# Altium schematic sheet sdcard_emmc.SchDoc
size A4
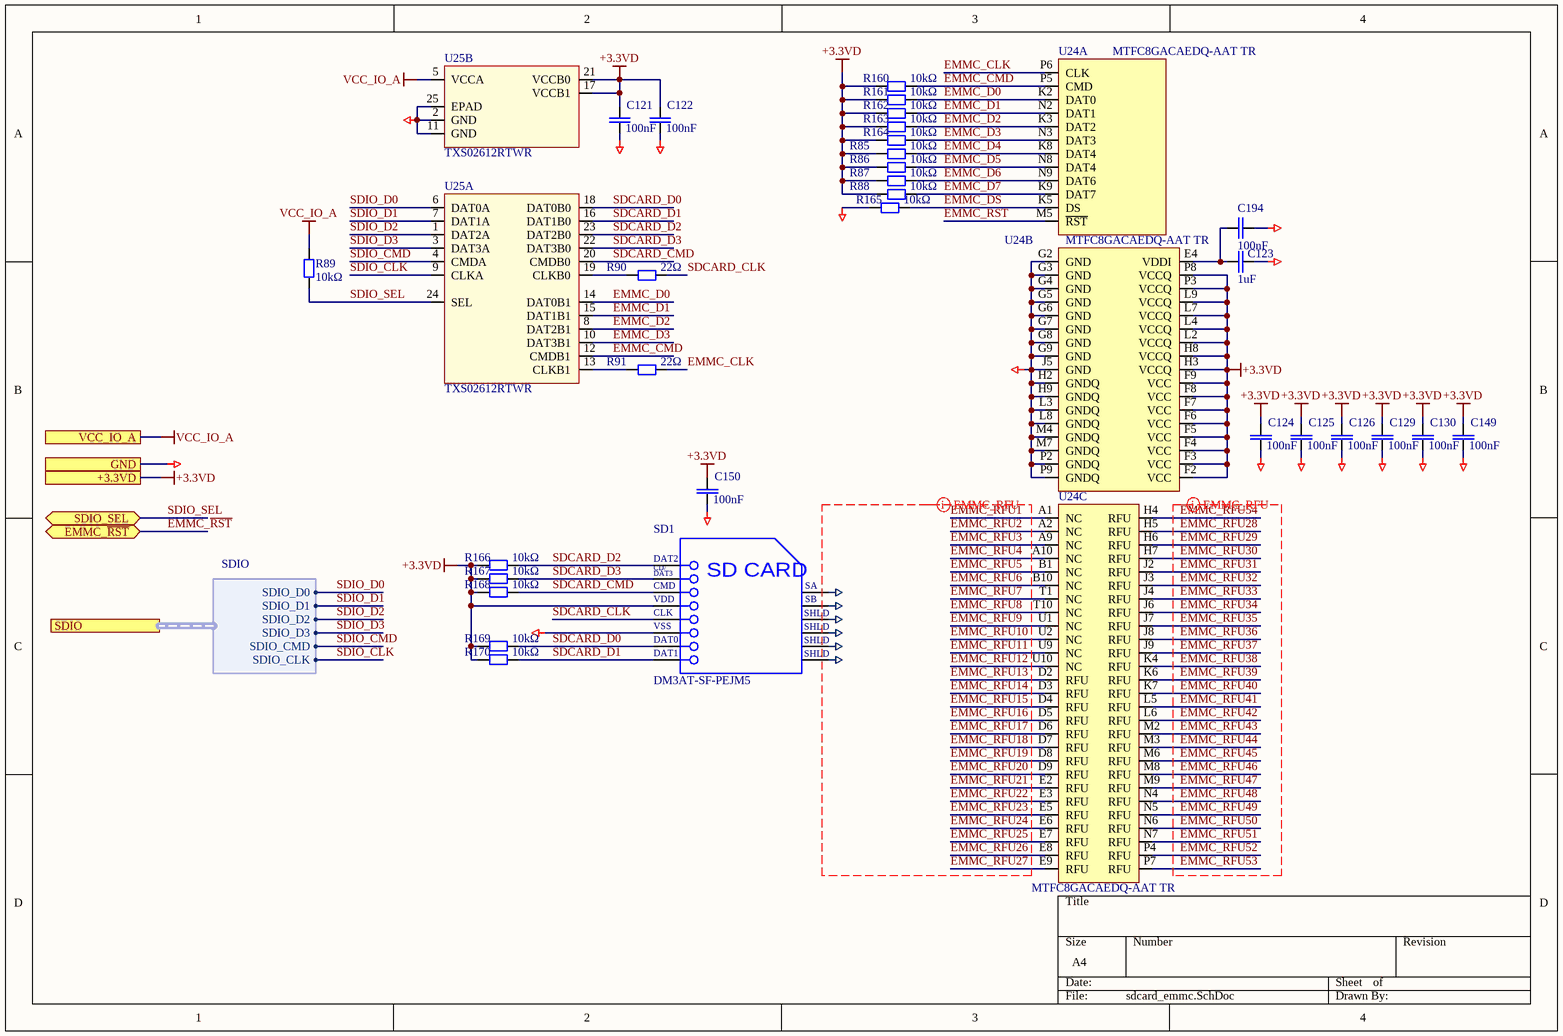
[diagram p0: sdcard_emmc.SchDoc]

## Parts
C121  100nF  [CAPC1608N]
C122  100nF  [CAPC1608N]
C123  1uF  [CAPC2012N]
C124  100nF  [CAPC1608N]
C125  100nF  [CAPC1608N]
C126  100nF  [CAPC1608N]
C129  100nF  [CAPC1608N]
C130  100nF  [CAPC1608N]
C149  100nF  [CAPC1608N]
C150  100nF  [CAPC1608N]
C194  100nF  [CAPC1608N]
R85  10kΩ  [RESC2012N]
R86  10kΩ  [RESC2012N]
R87  10kΩ  [RESC2012N]
R88  10kΩ  [RESC2012N]
R89  10kΩ  [RESC2012N]
R90  22Ω  [RESC1608N]
R91  22Ω  [RESC1608N]
R160  10kΩ  [RESC2012N]
R161  10kΩ  [RESC2012N]
R162  10kΩ  [RESC2012N]
R163  10kΩ  [RESC2012N]
R164  10kΩ  [RESC2012N]
R165  10kΩ  [RESC2012N]
R166  10kΩ  [RESC2012N]
R167  10kΩ  [RESC2012N]
R168  10kΩ  [RESC2012N]
R169  10kΩ  [RESC2012N]
R170  10kΩ  [RESC2012N]
SD1  DM3AT-SF-PEJM5  [SD_HRS-DM3AT-8_V]
U24  MTFC8GACAEDQ-AAT TR  [BGA100C100P10X17_1400X1800X120]  (parts A,B,C of 3)
U25  TXS02612RTWR  [QFN50P400X400X80-25N-S245]  (parts A,B of 2)

## Ports
+3.3VD, EMMC_~{RST} (bidir), GND, SDIO (harness SDIO), SDIO_SEL (bidir), VCC_IO_A

## Harnesses
SDIO: SDIO_D0, SDIO_D1, SDIO_D2, SDIO_D3, SDIO_CMD, SDIO_CLK

## Nets
+3.3VD: C121.1 C122.1 C124.1 C125.1 C126.1 C129.1 C130.1 C149.1 C150.1 R85.1 R86.1 R87.1 R88.1 R160.1 R161.1 R162.1 R163.1 R164.1 R166.1 R167.1 R168.1 R169.1 R170.1 SD1.4(VDD) U24.F2(VCC) U24.F3(VCC) U24.F4(VCC) U24.F5(VCC) U24.F6(VCC) U24.F7(VCC) U24.F8(VCC) U24.F9(VCC) U24.H3(VCCQ) U24.H8(VCCQ) U24.L2(VCCQ) U24.L4(VCCQ) U24.L7(VCCQ) U24.L9(VCCQ) U24.P3(VCCQ) U24.P8(VCCQ) U25.17(VCCB1) U25.21(VCCB0) ; port +3.3VD
GND: C121.2 C122.2 C123.1 C124.2 C125.2 C126.2 C129.2 C130.2 C149.2 C150.2 C194.2 R165.1 SD1.6(VSS) U24.G2(GND) U24.G3(GND) U24.G4(GND) U24.G5(GND) U24.G6(GND) U24.G7(GND) U24.G8(GND) U24.G9(GND) U24.H2(GNDQ) U24.H9(GNDQ) U24.J5(GND) U24.L3(GNDQ) U24.L8(GNDQ) U24.M4(GNDQ) U24.M7(GNDQ) U24.P2(GNDQ) U24.P9(GNDQ) U25.2(GND) U25.11(GND) U25.25(EPAD) ; port GND
SDEPAD1: SD1.9(SA)
SDEPAD2: SD1.10(SB)
SDEPAD3: SD1.11(SHLD)
SDEPAD4: SD1.13(SHLD)
SDEPAD5: SD1.12(SHLD)
SDEPAD6: SD1.14(SHLD)
VCC_IO_A: R89.2 U25.5(VCCA) ; port VCC_IO_A
EMMC_CLK: R91.2 U24.P6(CLK)
EMMC_CMD: R160.2 U24.P5(CMD) U25.12(CMDB1)
EMMC_D0: R161.2 U24.K2(DAT0) U25.14(DAT0B1)
EMMC_D1: R162.2 U24.N2(DAT1) U25.15(DAT1B1)
EMMC_D2: R163.2 U24.K3(DAT2) U25.8(DAT2B1)
EMMC_D3: R164.2 U24.N3(DAT3) U25.10(DAT3B1)
EMMC_D4: R85.2 U24.K8(DAT4)
EMMC_D5: R86.2 U24.N8(DAT4)
EMMC_D6: R87.2 U24.N9(DAT6)
EMMC_D7: R88.2 U24.K9(DAT7)
EMMC_DS: R165.2 U24.K5(DS)
EMMC_~{RST}: U24.M5(~{RST}) ; port EMMC_~{RST}
EMMC_RFU1: U24.A1(NC)
EMMC_RFU2: U24.A2(NC)
EMMC_RFU3: U24.A9(NC)
EMMC_RFU4: U24.A10(NC)
EMMC_RFU5: U24.B1(NC)
EMMC_RFU6: U24.B10(NC)
EMMC_RFU7: U24.T1(NC)
EMMC_RFU8: U24.T10(NC)
EMMC_RFU9: U24.U1(NC)
EMMC_RFU10: U24.U2(NC)
EMMC_RFU11: U24.U9(NC)
EMMC_RFU12: U24.U10(NC)
EMMC_RFU13: U24.D2(RFU)
EMMC_RFU14: U24.D3(RFU)
EMMC_RFU15: U24.D4(RFU)
EMMC_RFU16: U24.D5(RFU)
EMMC_RFU17: U24.D6(RFU)
EMMC_RFU18: U24.D7(RFU)
EMMC_RFU19: U24.D8(RFU)
EMMC_RFU20: U24.D9(RFU)
EMMC_RFU21: U24.E2(RFU)
EMMC_RFU22: U24.E3(RFU)
EMMC_RFU23: U24.E5(RFU)
EMMC_RFU24: U24.E6(RFU)
EMMC_RFU25: U24.E7(RFU)
EMMC_RFU26: U24.E8(RFU)
EMMC_RFU27: U24.E9(RFU)
EMMC_RFU28: U24.H5(RFU)
EMMC_RFU29: U24.H6(RFU)
EMMC_RFU30: U24.H7(RFU)
EMMC_RFU31: U24.J2(RFU)
EMMC_RFU32: U24.J3(RFU)
EMMC_RFU33: U24.J4(RFU)
EMMC_RFU34: U24.J6(RFU)
EMMC_RFU35: U24.J7(RFU)
EMMC_RFU36: U24.J8(RFU)
EMMC_RFU37: U24.J9(RFU)
EMMC_RFU38: U24.K4(RFU)
EMMC_RFU39: U24.K6(RFU)
EMMC_RFU40: U24.K7(RFU)
EMMC_RFU41: U24.L5(RFU)
EMMC_RFU42: U24.L6(RFU)
EMMC_RFU43: U24.M2(RFU)
EMMC_RFU44: U24.M3(RFU)
EMMC_RFU45: U24.M6(RFU)
EMMC_RFU46: U24.M8(RFU)
EMMC_RFU47: U24.M9(RFU)
EMMC_RFU48: U24.N4(RFU)
EMMC_RFU49: U24.N5(RFU)
EMMC_RFU50: U24.N6(RFU)
EMMC_RFU51: U24.N7(RFU)
EMMC_RFU52: U24.P4(RFU)
EMMC_RFU53: U24.P7(RFU)
EMMC_RFU54: U24.H4(RFU)
SDCARD_CLK: R90.2 SD1.5(CLK)
SDCARD_CMD: R168.2 SD1.3(CMD) U25.20(CMDB0)
SDCARD_D0: R169.2 SD1.7(DAT0) U25.18(DAT0B0)
SDCARD_D1: R170.2 SD1.8(DAT1) U25.16(DAT1B0)
SDCARD_D2: R166.2 SD1.1(DAT2) U25.23(DAT2B0)
SDCARD_D3: R167.2 SD1.2(CD/DAT3) U25.22(DAT3B0)
SDIO_CLK: U25.9(CLKA) ; port SDIO.SDIO_CLK
SDIO_CMD: U25.4(CMDA) ; port SDIO.SDIO_CMD
SDIO_D0: U25.6(DAT0A) ; port SDIO.SDIO_D0
SDIO_D1: U25.7(DAT1A) ; port SDIO.SDIO_D1
SDIO_D2: U25.1(DAT2A) ; port SDIO.SDIO_D2
SDIO_D3: U25.3(DAT3A) ; port SDIO.SDIO_D3
SDIO_SEL: R89.1 U25.24(SEL) ; port SDIO_SEL
NetC123_2: C123.2 C194.1 U24.E4(VDDI)
NetR90_1: R90.1 U25.19(CLKB0)
NetR91_1: R91.1 U25.13(CLKB1)

## Layout directives
differential pair; net class EMMC_RFU: EMMC_RFU1, EMMC_RFU2, EMMC_RFU3, EMMC_RFU4, EMMC_RFU5, EMMC_RFU6, EMMC_RFU7, EMMC_RFU8, EMMC_RFU9, EMMC_RFU10, EMMC_RFU11, EMMC_RFU12, EMMC_RFU13, EMMC_RFU14, EMMC_RFU15, EMMC_RFU16, EMMC_RFU17, EMMC_RFU18, EMMC_RFU19, EMMC_RFU20, EMMC_RFU21, EMMC_RFU22, EMMC_RFU23, EMMC_RFU24, EMMC_RFU25, EMMC_RFU26, EMMC_RFU27, EMMC_RFU28, EMMC_RFU29, EMMC_RFU30, EMMC_RFU31, EMMC_RFU32, EMMC_RFU33, EMMC_RFU34, EMMC_RFU35, EMMC_RFU36, EMMC_RFU37, EMMC_RFU38, EMMC_RFU39, EMMC_RFU40, EMMC_RFU41, EMMC_RFU42, EMMC_RFU43, EMMC_RFU44, EMMC_RFU45, EMMC_RFU46, EMMC_RFU47, EMMC_RFU48, EMMC_RFU49, EMMC_RFU50, EMMC_RFU51, EMMC_RFU52, EMMC_RFU53, EMMC_RFU54, SDEPAD1, SDEPAD2, SDEPAD3, SDEPAD4, SDEPAD5, SDEPAD6

## Notes on the sheet
- (in symbol DM3AT-SF-PEJM5) CD/; DAT3; SD CARD

## Library data of the parts
C121 C122 C124-C126 C129 C130 C149 C150 C194 = CAPC: Generic ceramic SMD capacitor; Pkg: 0603; Maintainer: Evgeniy Kotov; SMD Solders: 2; THD Solders: 0; PartField: 100nF; Last Change Data: 06.03.2017; Release Date: 06.03.2017; Value: 100nF
C123 = CAPC: Generic ceramic SMD capacitor; Pkg: 0805; Maintainer: Evgeniy Kotov; SMD Solders: 2; THD Solders: 0; Voltage Rating: 10V; PartField: 1uF; Last Change Data: 06.03.2017; Release Date: 06.03.2017; Value: 1uF
R85-R89 R160-R170 = RESC: Resistor, Generic, SMD; Pkg: 0805; Maintainer: Evgeniy Kotov; SMD Solders: 2; THD Solders: 0; PartField: 10kΩ; Release Date: 06.03.2017; Last Change Data: 09.03.2017; Value: 10kΩ
R90 R91 = RESC: Resistor, Generic, SMD; Pkg: 0603; Maintainer: Evgeniy Kotov; SMD Solders: 2; THD Solders: 0; PartField: 22Ω; Release Date: 06.03.2017; Last Change Data: 09.03.2017; Value: 22Ω
SD1 = DM3AT-SF-PEJM5: Micro SD Card Connector, 0.5 A, 125 V, -25 to 85 degC, 8-Pin SMD, RoHS, Tape and Reel; Manufacturer: Hirose Electric; Featured Product: DM3ATSeries; HTML Datasheet: DM3SeriesmicroSD.html; Other Names: HR1964DKR; Connector Type: ConnectorandEjector; Insertion, Removal Method: PushIn,PushOut; Card Type: SecureDigital-microSD™; Online Catalog: DM3Series; Number of Positions: 10(8+2); Product Training Modules: DM3SeriesmicroSDCardSockets; Pkg: SD card hlder; SMD Solders: 14; THD Solders: 0; Manufacturer URL: https://www.hirose.com; Contact Finish: Gold; Family: MemoryConnectors-PCCardSockets; Package Reference: DM3AT-8; Category: Connectors,Interconnects; Features: Switch; Mounting Type: SurfaceMount,RightAngle; Datasheet Version: Jun-10; Package Description: 8-Pin Surface Mount Device, Body 16.15 x 13.85 mm, Pitch 1.1 mm; Standard Package: 1; Contact Finish Thickness: -; Datasheet URL: https://ciiva.com/datasheet-click-46418261?src=ciiva&sig=4019062a; Mounting Feature: Normal,Standard-Top; Series: DM3; Packaging: Digi-Reel; Package URL: https://www.hirose.com/product/en/download_file/key_name/DM3/category/Catalog/doc_file_id/49662/?file_category_id=4&item_id=195&is_series=1; Ejector Side: -; Value: DM3AT-SF-PEJM5; Vendor: Hirose Electric; PartField: DM3AT-SF-PEJM5
U24 = MTFC32GAKAENA: Pkg: LBGA-100; SMD Solders: 100; THD Solders: 0; Value: MTFC8GACAEDQ-AAT TR; PartField: MTFC8GACAEDQ-AAT TR
U25 = TXS02612_RTW_24: IC SDIO PORT EXPANDER AND LEVEL SHIFTER; Vendor: Texas Instruments; PACKAGE_DESIGNATOR: RTW; PIN_COUNT: 24; FAMILY_NAME: APPLICATION SPECIFIC (COMPACT FLASH, SD, MMC, I2C); INDUSTRY_STD_PKG_TYPE: QFN; Pkg: QFN-24EP; SMD Solders: 25; THD Solders: 0; Manufacturer_Part_Number: txs02612_rtw_24; GENERIC_PART_NUMBER: TXS02612RTWR; Datasheet URL: http://www.ti.com/lit/gpn/TXS02612; Manufacturer: Texas Instruments; RefDes: RefDes; Type: DEV; Value: TXS02612RTWR; PartField: TXS02612RTWR